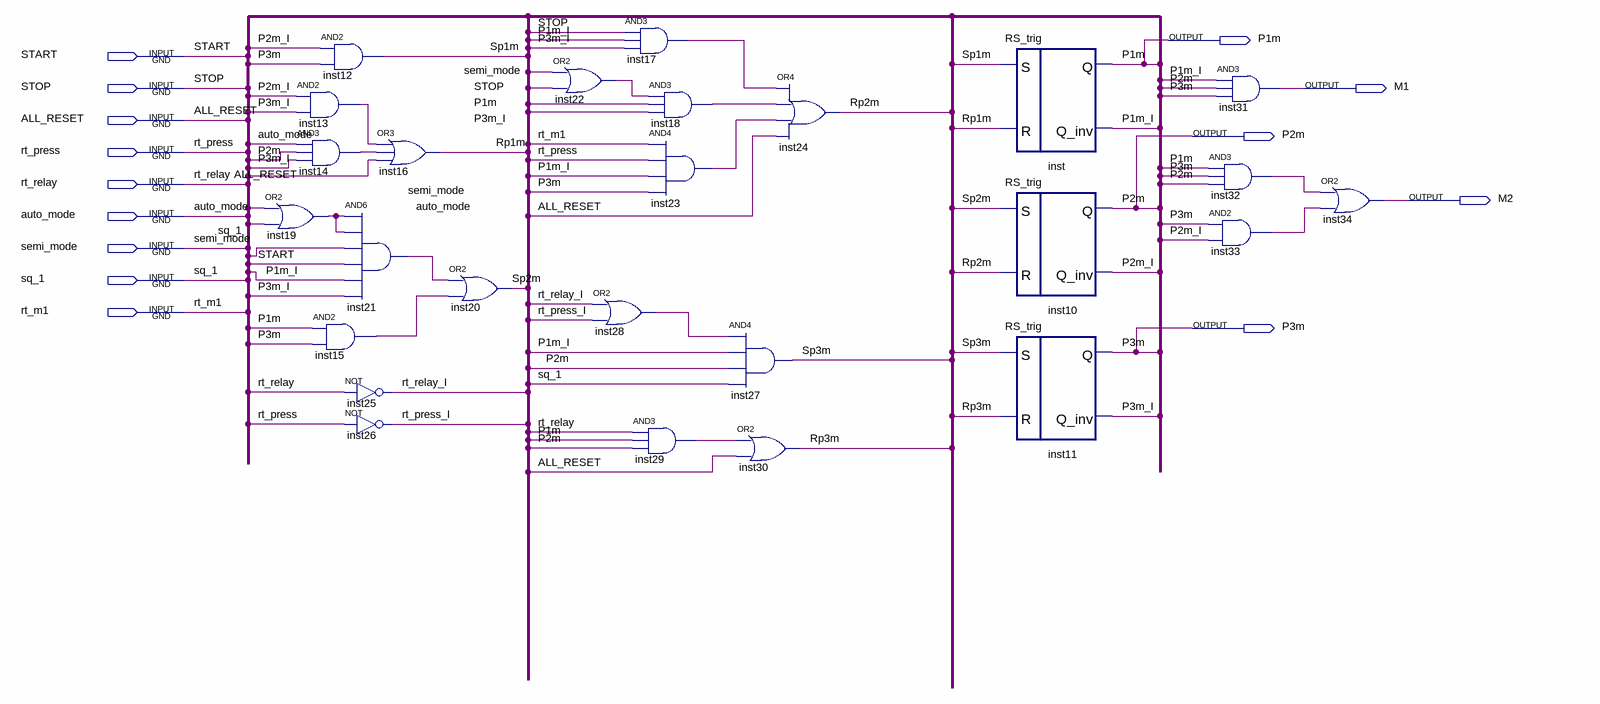
[diagram p0: schematic sheet]
// Quartus schematic auto_table.bdf as structural Verilog: 26 symbols, 14 pins
module auto_table (
  input  START,
  input  STOP,
  input  ALL_RESET,
  input  rt_press,
  input  rt_relay,
  input  auto_mode,
  input  semi_mode,
  input  sq_1,
  input  rt_m1,
  output P1m,
  output M1,
  output P2m,
  output M2,
  output P3m
);

  wire inst13_out, inst14_out, inst15_out, inst17_out, inst18_out, inst19_out, inst21_out, inst22_out,
       inst23_out, inst28_out, inst29_out, inst32_out, inst33_out, P1m_I, P2m_I, P3m_I, Rp1m, Rp2m, Rp3m,
       rt_press_I, rt_relay_I, Sp1m, Sp2m, Sp3m;

  or inst19 (inst19_out, semi_mode, auto_mode);
  and inst12 (Sp1m, P2m_I, P3m);
  and inst13 (inst13_out, P2m_I, P3m_I);
  and inst14 (inst14_out, auto_mode, P2m, P3m_I);
  and inst21 (inst21_out, inst19_out, inst19_out, sq_1, START, P1m_I, P3m_I);
  and inst15 (inst15_out, P1m, P3m);
  not inst25 (rt_relay_I, rt_relay);
  not inst26 (rt_press_I, rt_press);
  or inst16 (Rp1m, inst13_out, inst14_out, ALL_RESET);
  or inst20 (Sp2m, inst21_out, inst15_out);
  or inst22 (inst22_out, semi_mode, STOP);
  or inst28 (inst28_out, rt_relay_I, rt_press_I);
  and inst17 (inst17_out, STOP, P1m_I, P3m_I);
  and inst18 (inst18_out, inst22_out, P1m, P3m_I);
  and inst23 (inst23_out, rt_m1, rt_press, P1m_I, P3m);
  and inst29 (inst29_out, rt_relay, P1m, P2m);
  and inst27 (Sp3m, inst28_out, P1m_I, P2m, sq_1);
  or inst30 (Rp3m, inst29_out, ALL_RESET);
  or inst24 (Rp2m, inst17_out, inst18_out, inst23_out, ALL_RESET);
  RS_trig inst (.S(Sp1m), .R(Rp1m), .Q(P1m), .Q_inv(P1m_I));
  RS_trig inst10 (.S(Sp2m), .R(Rp2m), .Q(P2m), .Q_inv(P2m_I));
  RS_trig inst11 (.S(Sp3m), .R(Rp3m), .Q(P3m), .Q_inv(P3m_I));
  and inst31 (M1, P1m_I, P2m, P3m);
  and inst32 (inst32_out, P1m, P3m, P2m);
  and inst33 (inst33_out, P3m, P2m_I);
  or inst34 (M2, inst32_out, inst33_out);
endmodule
